# Altium schematic sheet RSD_M1_HELMET_UNIT_POWER_STOP_LIGHT_V2.SchDoc
size A4
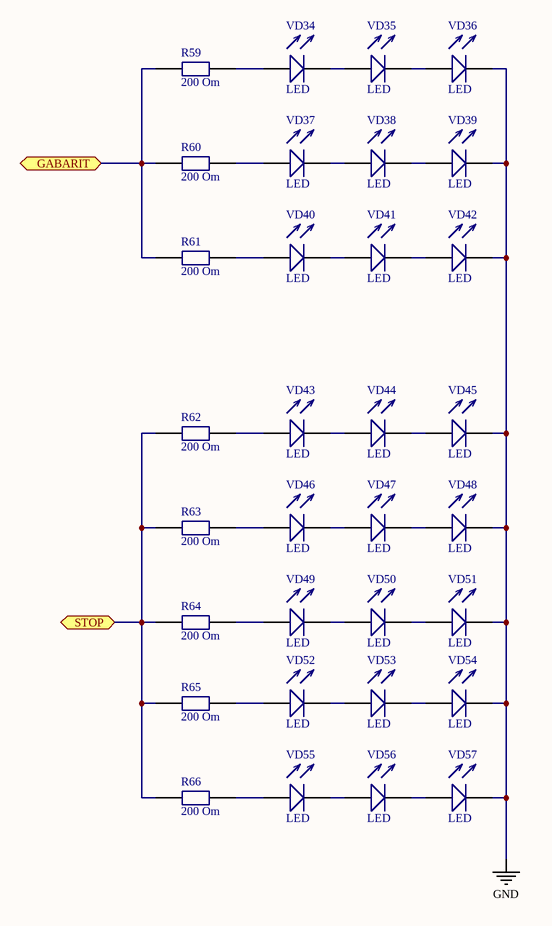
[diagram p0: RSD_M1_HELMET_UNIT_POWER_STOP_LIGHT_V2.SchDoc]

## Parts
R59  value 200 Om  [Res0603]  (hidden comment: Resistor)
R60  value 200 Om  [Res0603]  (hidden comment: Resistor)
R61  value 200 Om  [Res0603]  (hidden comment: Resistor)
R62  value 200 Om  [Res0603]  (hidden comment: Resistor)
R63  value 200 Om  [Res0603]  (hidden comment: Resistor)
R64  value 200 Om  [Res0603]  (hidden comment: Resistor)
R65  value 200 Om  [Res0603]  (hidden comment: Resistor)
R66  value 200 Om  [Res0603]  (hidden comment: Resistor)
VD34  LED  [3528_LED]
VD35  LED  [3528_LED]
VD36  LED  [3528_LED]
VD37  LED  [3528_LED]
VD38  LED  [3528_LED]
VD39  LED  [3528_LED]
VD40  LED  [3528_LED]
VD41  LED  [3528_LED]
VD42  LED  [3528_LED]
VD43  LED  [3528_LED]
VD44  LED  [3528_LED]
VD45  LED  [3528_LED]
VD46  LED  [3528_LED]
VD47  LED  [3528_LED]
VD48  LED  [3528_LED]
VD49  LED  [3528_LED]
VD50  LED  [3528_LED]
VD51  LED  [3528_LED]
VD52  LED  [3528_LED]
VD53  LED  [3528_LED]
VD54  LED  [3528_LED]
VD55  LED  [3528_LED]
VD56  LED  [3528_LED]
VD57  LED  [3528_LED]

## Ports
GABARIT, STOP

## Nets
GND: VD36.1 VD39.1 VD42.1 VD45.1 VD48.1 VD51.1 VD54.1 VD57.1
GABARIT: R59.2 R60.2 R61.2 ; port GABARIT
STOP: R62.2 R63.2 R64.2 R65.2 R66.2 ; port STOP
NetR59_1: R59.1 VD34.2
NetR60_1: R60.1 VD37.2
NetR61_1: R61.1 VD40.2
NetR62_1: R62.1 VD43.2
NetR63_1: R63.1 VD46.2
NetR64_1: R64.1 VD49.2
NetR65_1: R65.1 VD52.2
NetR66_1: R66.1 VD55.2
NetVD34_1: VD34.1 VD35.2
NetVD35_1: VD35.1 VD36.2
NetVD37_1: VD37.1 VD38.2
NetVD38_1: VD38.1 VD39.2
NetVD40_1: VD40.1 VD41.2
NetVD41_1: VD41.1 VD42.2
NetVD43_1: VD43.1 VD44.2
NetVD44_1: VD44.1 VD45.2
NetVD46_1: VD46.1 VD47.2
NetVD47_1: VD47.1 VD48.2
NetVD49_1: VD49.1 VD50.2
NetVD50_1: VD50.1 VD51.2
NetVD52_1: VD52.1 VD53.2
NetVD53_1: VD53.1 VD54.2
NetVD55_1: VD55.1 VD56.2
NetVD56_1: VD56.1 VD57.2

## Library data of the parts
VD34-VD57 = LED: Value: LED